# EAGLE design Sensorino (EAGLE 6.4)
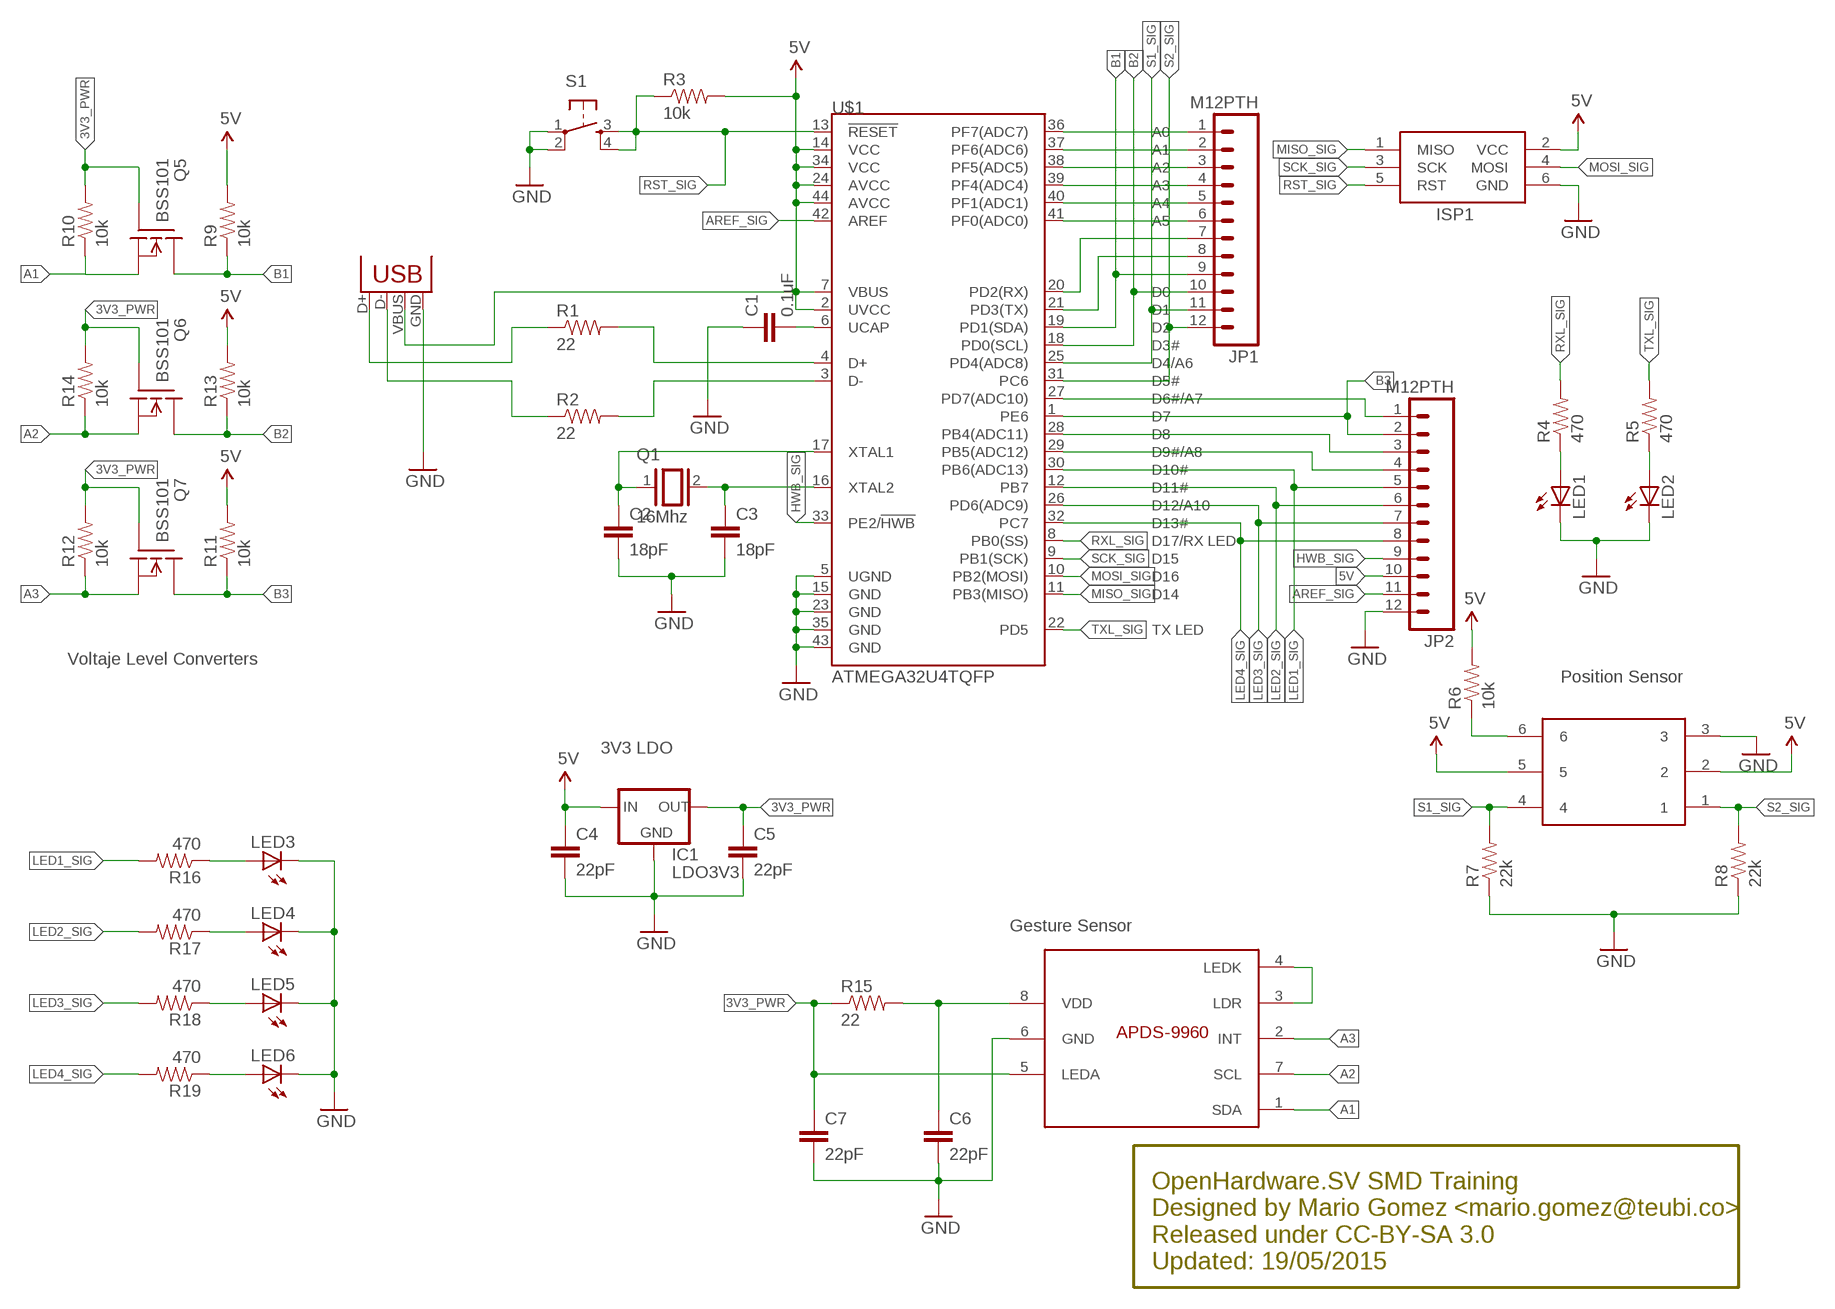
[diagram p0: schematic, sheet 1]

## Parts
C1  0.1uF  0.1UF-50V-20%(PTH)KIT-EZ  [CAP-PTH-SMALL-KIT]
C2  18pF  0.1UF-50V-20%(PTH)KIT-EZ  [CAP-PTH-SMALL-KIT]
C3  18pF  0.1UF-50V-20%(PTH)KIT-EZ  [CAP-PTH-SMALL-KIT]
C4  22pF  0.1UF-50V-20%(PTH)KIT-EZ  [CAP-PTH-SMALL-KIT]
C5  22pF  0.1UF-50V-20%(PTH)KIT-EZ  [CAP-PTH-SMALL-KIT]
C6  22pF  0.1UF-50V-20%(PTH)KIT-EZ  [CAP-PTH-SMALL-KIT]
C7  22pF  0.1UF-50V-20%(PTH)KIT-EZ  [CAP-PTH-SMALL-KIT]
IC1  LDO3V3  78XXL  [78XXL]
ISP1  AVRISP-6  [AVRISP]
JP1  M12PTH  [1X12]
JP2  M12PTH  [1X12]
LED1  LED5MM  [LED5MM]
LED2  LED5MM  [LED5MM]
LED3  LED5MM  [LED5MM]
LED4  LED5MM  [LED5MM]
LED5  LED5MM  [LED5MM]
LED6  LED5MM  [LED5MM]
Q1  16Mhz  XTAL/S  [QS]
Q5  BSS101  [TO92]
Q6  BSS101  [TO92]
Q7  BSS101  [TO92]
R1  22  RESISTORAXIAL-0.3  [AXIAL-0.3]
R2  22  RESISTORAXIAL-0.3  [AXIAL-0.3]
R3  10k  RESISTORAXIAL-0.3  [AXIAL-0.3]
R4  470  RESISTORAXIAL-0.3  [AXIAL-0.3]
R5  470  RESISTORAXIAL-0.3  [AXIAL-0.3]
R6  10k  RESISTORAXIAL-0.3  [AXIAL-0.3]
R7  22k  RESISTORAXIAL-0.3  [AXIAL-0.3]
R8  22k  RESISTORAXIAL-0.3  [AXIAL-0.3]
R9  10k  RESISTORAXIAL-0.3  [AXIAL-0.3]
R10  10k  RESISTORAXIAL-0.3  [AXIAL-0.3]
R11  10k  RESISTORAXIAL-0.3  [AXIAL-0.3]
R12  10k  RESISTORAXIAL-0.3  [AXIAL-0.3]
R13  10k  RESISTORAXIAL-0.3  [AXIAL-0.3]
R14  10k  RESISTORAXIAL-0.3  [AXIAL-0.3]
R15  22  RESISTORAXIAL-0.3  [AXIAL-0.3]
R16  470  RESISTORAXIAL-0.3  [AXIAL-0.3]
R17  470  RESISTORAXIAL-0.3  [AXIAL-0.3]
R18  470  RESISTORAXIAL-0.3  [AXIAL-0.3]
R19  470  RESISTORAXIAL-0.3  [AXIAL-0.3]
S1  TAC_SWITCHPTH  [TACTILE-PTH]
U$1  ATMEGA32U4TQFP  [SPARKFUN-DIGITALIC_TQFP44]
U$2  USBPTH  [USB-B-PTH]
U$3  RPI-1031  [RPI-1031]
U$4  APDS-9960  [APDS-9960]

## Nets
3V3_PWR: C5.1 C7.1 IC1.OUT Q5.2(G) Q6.2(G) Q7.2(G) R10.P$2 R12.P$2 R14.P$2 R15.P$1 U$4.5(LEDA)
5V: C4.1 IC1.IN ISP1.2(VCC) JP2.10 R3.P$2 R6.P$2 R9.P$2 R11.P$2 R13.P$2 U$1.2(UVCC) U$1.7(VBUS) U$1.14(VCC) U$1.24(AVCC) U$1.34(VCC) U$1.44(AVCC) U$2.VBUS U$3.2 U$3.5
A1: Q5.1(S) R10.P$1 U$4.1(SDA)
A2: Q6.1(S) R14.P$1 U$4.7(SCL)
A3: Q7.1(S) R12.P$1 U$4.2(INT)
AREF_SIG: JP2.11 U$1.42(AREF)
B1: JP1.9 Q5.3(D) R9.P$1 U$1.19(PD1(SDA))
B2: JP1.10 Q6.3(D) R13.P$1 U$1.18(PD0(SCL))
B3: JP2.2 Q7.3(D) R11.P$1 U$1.1(PE6)
GND: C1.1 C2.2 C3.2 C4.2 C5.2 C6.2 C7.2 IC1.GND ISP1.6(GND) JP2.12 LED1.K(C) LED2.K(C) LED3.K(C) LED4.K(C) LED5.K(C) LED6.K(C) R7.P$1 R8.P$1 S1.1 S1.2 U$1.5(UGND) U$1.15(GND) U$1.23(GND) U$1.35(GND) U$1.43(GND) U$2.GND U$3.3 U$4.6(GND)
HWB_SIG: JP2.9 U$1.33(PE2/!HWB)
LED1_SIG: JP2.5 R16.P$2 U$1.30(PB6(ADC13))
LED2_SIG: JP2.6 R17.P$2 U$1.12(PB7)
LED3_SIG: JP2.7 R18.P$2 U$1.26(PD6(ADC9))
LED4_SIG: JP2.8 R19.P$2 U$1.32(PC7)
MISO_SIG: ISP1.1(MISO) U$1.11(PB3(MISO))
MOSI_SIG: ISP1.4(MOSI) U$1.10(PB2(MOSI))
N$1: R2.P$2 U$1.3(D-)
N$2: R1.P$2 U$1.4(D+)
N$3: R1.P$1 U$2.D+
N$4: R2.P$1 U$2.D-
N$5: JP2.1 U$1.27(PD7(ADC10))
N$6: C1.2 U$1.6(UCAP)
N$7: C3.1 Q1.2 U$1.16(XTAL2)
N$8: C2.1 Q1.1 U$1.17(XTAL1)
N$9: LED3.A R16.P$1
N$10: JP2.3 U$1.28(PB4(ADC11))
N$11: LED1.A R4.P$1
N$12: LED2.A R5.P$1
N$13: JP1.1 U$1.36(PF7(ADC7))
N$14: JP1.2 U$1.37(PF6(ADC6))
N$15: JP1.3 U$1.38(PF5(ADC5))
N$16: JP1.4 U$1.39(PF4(ADC4))
N$17: JP1.5 U$1.40(PF1(ADC1))
N$18: JP1.6 U$1.41(PF0(ADC0))
N$19: JP1.7 U$1.20(PD2(RX))
N$20: JP1.8 U$1.21(PD3(TX))
N$21: LED4.A R17.P$1
N$22: LED5.A R18.P$1
N$23: LED6.A R19.P$1
N$25: JP2.4 U$1.29(PB5(ADC12))
N$30: R6.P$1 U$3.6
N$31: U$4.3(LDR) U$4.4(LEDK)
N$32: C6.1 R15.P$2 U$4.8(VDD)
RST_SIG: ISP1.5(RST) R3.P$1 S1.3 S1.4 U$1.13(!RESET)
RXL_SIG: R4.P$2 U$1.8(PB0(SS))
S1_SIG: JP1.11 R7.P$2 U$1.25(PD4(ADC8)) U$3.4
S2_SIG: JP1.12 R8.P$2 U$1.31(PC6) U$3.1
SCK_SIG: ISP1.3(SCK) U$1.9(PB1(SCK))
TXL_SIG: R5.P$2 U$1.22(PD5)

## Notes on the sheet
- Voltaje Level Converters
- Position Sensor
- 3V3 LDO
- Gesture Sensor
- OpenHardware.SV SMD Training
  Designed by Mario Gomez <mario.gomez@teubi.co>
  Released under CC-BY-SA 3.0
  Updated: 19/05/2015

## Library data of the parts
C1-C7 = SparkFun-Capacitors:0.1UF-50V-20%(PTH): CAP-08370; PROD_ID: CAP-08370
IC1 = v-reg:78XXL: VOLTAGE REGULATOR
ISP1 = adafruit:AVRISP: AVR ISP HEADER Standard 6 pin header for AVR programming
JP1 JP2 = SparkFun-Connectors:M12: Header 12 Standard 12-pin 0.1" header. Use with straight break away headers (SKU : PRT-00116), right angle break away headers (PRT-00553), swiss pins (PRT-00743), machine pins (PRT-00117), and female headers (PRT-00115).
LED1-LED6 = SparkFun-LED:LED: LEDs Standard schematic elements and footprints for 5mm, 3mm, 1206, and 0603 sized LEDs. 5mm - Spark Fun Electronics SKU : COM-00529 (and others)
Q1 = special:XTAL/S: CRYSTAL
Q5-Q7 = transistor-fet:BSS101: N-Channel Enhancement MOSFET 200V; 0,16A; 11Ohm
R1-R19 = SparkFun-Resistors:RESISTOR: Resistor Basic schematic elements and footprints for 0603, 1206, and PTH resistors.
S1 = SparkFun-Electromechanical:TAC_SWITCH: Momentary Switch Button commonly used for reset or general input. Spark Fun Electronics SKU : COM-00097 SMT- SWCH-08247
U$1 = SparkFun-DigitalIC:ATMEGA32U4: Atmel 44-pin 8-bit Microcontroller with 32KBytes of ISP Flash and USB Controller ----- Please use the QFN-44-NOPAD_1:1 package for the footprint of all boards using a 32U4. Route traces directly away from the pads as much as possible.
U$2 = SparkFun-Connectors:USB: USB Connectors USB-B-PTH is fully proven SKU : PRT-00139/CONN-08278 USB-miniB is fully proven SKU : PRT-00587 USB-A-PCB is untested. USB-A-H is throughly reviewed, but untested. Spark Fun Electronics SKU : PRT-00437 USB-B-SMT is throughly reviewed, but untested. Needs silkscreen touching up. USB-A-S has not been used/tested USB-MB-H has not been used/tested USB-MICROB has been used. CONN-09505; PROD_ID: CONN-08278; VALUE: USB-B
U$3 = custom_components:RPI-1031
U$4 = custom_components:APDS-9960

## Board
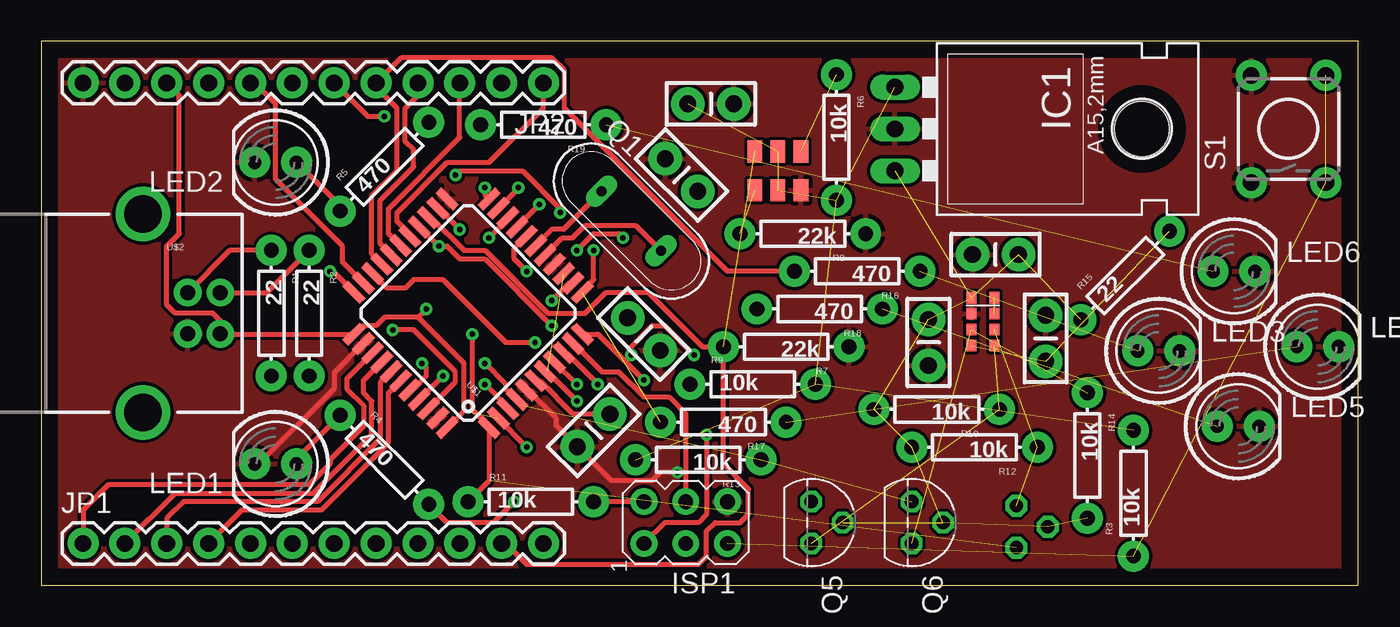
[diagram p1: board, top side]
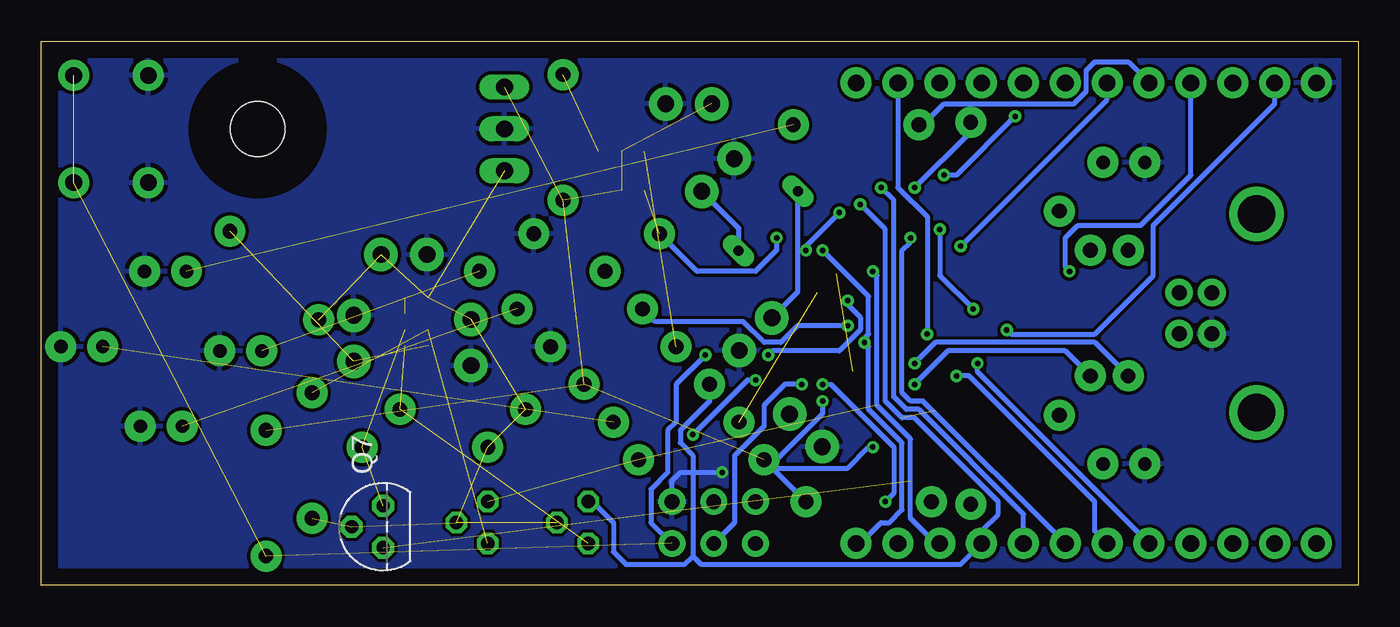
[diagram p2: board, bottom side, seen from below]

Size 79.93 x 33.01 mm. Coordinates in mm from the lower left corner, seen from the top.
Outline: 0,0 79.93,0 79.93,33.01 0,33.01 0,0
Copper layers (1*16): Top 0.035mm / dielectric 1.5mm / Bottom 0.035mm
Design rules "default": minimum track width 10mil, minimum drill 24mil, track to track 8mil, track to pad 8mil, pad to pad 8mil, via to via 8mil, smd to smd 8mil, copper to edge 40mil, drill to drill 8mil, minimum pad ring 10mil, minimum via ring 8mil, stop-mask expansion 4mil, vias tented up to drill 0mil, thermal gap 10mil

### Footprints (pad centres in the part's own frame; a part is rotated, then mirrored left to right if it is on the bottom)
CAP-PTH-SMALL-KIT = drill 1.016 pad 2.032: 1 -1.397,0; 2 1.397,0
78XXL = drill 1.016 long: GND 0,-3.81; IN -2.54,-3.81; OUT 2.54,-3.81 | hole 3.302: 0,11.176
AVRISP = drill 0.9 pad 1.626: 1 -1.27,2.54; 2 1.27,2.54; 3 -1.27,0; 4 1.27,0; 5 -1.27,-2.54; 6 1.27,-2.54
1X12 = drill 1.016 pad 1.88: 1 0,0; 2 2.54,0; 3 5.08,0; 4 7.62,0; 5 10.16,0; 6 12.7,0; 7 15.24,0; 8 17.78,0; 9 20.32,0; 10 22.86,0; 11 25.4,0; 12 27.94,0
LED5MM = drill 0.813 pad 1.88: A -1.27,0; K 1.27,0
QS = drill 0.61 long: 1 -2.54,0; 2 2.54,0
TO92 = drill 0.813 octagon: 1 1.27,0; 2 0,1.905; 3 -1.27,0
AXIAL-0.3 = drill 0.9 pad 1.88: P$1 -3.81,0; P$2 3.81,0
TACTILE-PTH = drill 1.016 pad 1.88: 1 -3.251,2.261; 2 3.251,2.261; 3 -3.251,-2.261; 4 3.251,-2.261
SPARKFUN-DIGITALIC_TQFP44 = smd 1.5 x 0.5: 1 -5.8,4; 2 -5.8,3.2; 3 -5.8,2.4; 4 -5.8,1.6; 5 -5.8,0.8; 6 -5.8,0; 7 -5.8,-0.8; 8 -5.8,-1.6; 9 -5.8,-2.4; 10 -5.8,-3.2; 11 -5.8,-4; 23 5.8,-4; 24 5.8,-3.2; 25 5.8,-2.4; 26 5.8,-1.6; 27 5.8,-0.8; 28 5.8,0; 29 5.8,0.8; 30 5.8,1.6; 31 5.8,2.4; 32 5.8,3.2; 33 5.8,4 | smd 0.5 x 1.5: 12 -4,-5.8; 13 -3.2,-5.8; 14 -2.4,-5.8; 15 -1.6,-5.8; 16 -0.8,-5.8; 17 0,-5.8; 18 0.8,-5.8; 19 1.6,-5.8; 20 2.4,-5.8; 21 3.2,-5.8; 22 4,-5.8; 34 4,5.8; 35 3.2,5.8; 36 2.4,5.8; 37 1.6,5.8; 38 0.8,5.8; 39 0,5.8; 40 -0.8,5.8; 41 -1.6,5.8; 42 -2.4,5.8; 43 -3.2,5.8; 44 -4,5.8
USB-B-PTH = drill 0.914 pad 1.676: D+ 0,1.25; D- 1.981,1.25; GND 0,-1.25; VBUS 1.981,-1.25 | drill 2.286: S1 -2.718,-6.02; S2 -2.718,6.02
RPI-1031 = smd 1.35 x 0.9: 1 1.175,-1.4; 2 1.175,0; 3 1.175,1.4; 4 -1.175,-1.4; 5 -1.175,0; 6 -1.175,1.4
APDS-9960 = smd 0.6 x 0.72: 1 -0.7,1.455; 2 -0.7,0.485; 3 -0.7,-0.485; 4 -0.7,-1.455; 5 0.7,-1.455; 6 0.7,-0.485; 7 0.7,0.485; 8 0.7,1.455

### Placement (x,y rotation side)
C1  33.53,9.4 45 top
C2  36.58,15.24 315 top
C3  38.86,24.89 135 top
C4  40.64,29.21 0 top
C5  57.91,20.07 180 top
C6  60.96,14.99 90 top
C7  53.85,14.73 270 top
IC1  55.63,27.69 270 top
ISP1  39.12,3.81 90 top
JP1  2.54,2.54 0 top
JP2  30.48,30.48 180 top
LED1  14.22,7.37 180 top
LED2  14.22,25.65 180 top
LED3  67.82,14.22 0 top
LED4  77.47,14.48 0 top
LED5  72.64,9.65 0 top
LED6  72.39,19.05 0 top
Q1  35.81,22.1 315 top
Q5  46.74,3.81 270 top
Q6  52.83,3.81 270 top
Q7  59.18,3.56 90 bottom
R1  13.97,16.51 270 top
R2  16.26,16.51 270 top
R3  66.29,5.59 90 top
R4  20.83,7.62 315 top
R5  20.83,25.4 45 top
R6  48.26,27.18 270 top
R7  45.21,14.48 180 top
R8  46.23,21.34 180 top
R9  43.18,12.19 0 top
R10  54.36,10.67 180 top
R11  29.72,5.08 0 top
R12  56.64,8.38 180 top
R13  39.88,7.62 180 top
R14  63.5,7.87 270 top
R15  65.79,18.8 45 top
R16  49.53,19.05 180 top
R17  41.4,9.91 180 top
R18  47.24,16.76 180 top
R19  30.48,27.94 180 top
S1  75.69,27.69 90 top
U$1  25.91,16.51 135 top
U$2  8.89,16.51 0 top
U$3  44.7,25.15 270 top
U$4  57.15,16 180 top

### Tracks (layer width: path | path; a pad name or v marks a point on that pad's centre or on a via)
3V3_PWR  (10 unrouted)
5V  (via drill 0.33 pad 0.18)  (9 unrouted)
  Top 0.305: U$1.7 30.71,12.97 v32.51,11.18 | v29.46,8.38 27.75,10.1 U$1.2 | U$1.44 25.65,10.6 25.65,13.46 22.86,16.26 | 22.86,16.26 20.83,16.26 20.32,15.75 19.56,15.75 19.05,15.24 U$1.34 10.89,15.24 U$2.VBUS 10.87,16.05 10.41,16.51 8.13,16.51 7.62,17.02 7.62,20.57 8.38,21.34 8.38,29.72 JP2.10 | U$1.24 24.12,22.87 v25.4,21.59 | v23.37,16.76 22.86,16.26 | ISP1.2 R11.P$2
  Bottom 0.305: v32.51,11.18 32.51,10.41 35.31,7.62 R13.P$2 | R13.P$2 35.56,7.11 30.99,7.11 29.72,8.38 v29.46,8.38 | v25.4,21.59 25.4,18.8 v23.37,16.76 | R13.P$2 R11.P$2
A1  (2 unrouted)
A2  (2 unrouted)
A3  (2 unrouted)
AREF_SIG  (via drill 0.33 pad 0.18)
  Top 0.305: U$1.42 25.15,12.35 25.15,12.95 22.61,15.49 v21.34,15.49
  Bottom 0.305: v21.34,15.49 21.08,15.24 16,15.24 12.45,18.8 12.45,21.84 5.08,29.21 JP2.11
B1  (via drill 0.33 pad 0.18)
  Top 0.305: v30.23,23.11 30.23,23.09 U$1.19
  Bottom 0.305: v30.23,23.11 28.7,21.59 28.7,11.18 27.69,10.16 26.92,10.16 21.84,5.08 21.84,4.32 22.86,3.3 JP1.9 24.13,1.27 39.88,1.27 40.39,1.78 | R9.P$1 39.37,11.18 41.15,9.4 41.15,8.64 40.39,7.87 40.39,1.78 | Q5.3 46.48,5.08 45.21,3.81 45.21,2.03 44.45,1.27 40.89,1.27 40.39,1.78
B2  (via drill 0.33 pad 0.18)  (2 unrouted)
  Top 0.305: v29.46,19.05 28.7,19.81 28.7,20.43 U$1.18
  Bottom 0.305: JP1.10 25.65,2.54 27.18,4.06 27.18,8.89 29.21,10.92 29.21,18.8 v29.46,19.05
B3  (via drill 0.33 pad 0.18)  (1 unrouted)
  Top 0.305: R11.P$1 27.18,6.35 U$1.1 27.18,9.65 26.16,10.67 v26.16,15.24
  Bottom 0.305: JP2.2 27.94,24.13 26.16,22.35 v26.16,15.24
GND  (via drill 0.33 pad 0.18)
  Top 0.305: U$1.35 17.78,12.91 17.78,11.94 13.21,7.37 LED1.K | U$1.5 29.56,11.84 31.24,10.16 31.24,9.71 C1.1 34.6,6.35 37.08,6.35 37.59,6.86 v38.61,6.86
  Bottom 0.305: ISP1.6 41.66,6.35 41.15,6.86 v38.61,6.86
  pour Top: 0,0 79.76,0 79.76,33.02 0,33.02
  pour Bottom: 0,0 79.76,0 79.76,33.02 0,33.02
HWB_SIG  (via drill 0.33 pad 0.18)
  Top 0.305: U$1.33 17.71,19.05 v17.53,19.05
  Bottom 0.305: v17.53,19.05 17.78,19.3 17.78,21.08 17.02,21.84 13.21,21.84 10.16,24.89 JP2.9
LED1_SIG
  Top 0.305: U$1.30 20.07,20.09 20.07,23.62 21.59,25.15 21.59,28.96 20.32,30.23 JP2.5 21.84,32 30.99,32 31.75,31.24 31.75,28.96 41.66,19.05 R16.P$2
LED2_SIG  (via drill 0.33 pad 0.18)  (1 unrouted)
  Top 0.305: JP2.6 19.81,28.45 v20.83,28.45 | v25.15,24.89 25.4,25.15 29.21,25.15 31.5,22.86 v31.5,22.61 | U$1.12 32.84,17.85 33.53,18.54 v33.53,20.32
  Bottom 0.305: v20.83,28.45 24.38,24.89 v25.15,24.89 | v31.5,22.61 33.53,20.57 v33.53,20.32
LED3_SIG  (via drill 0.33 pad 0.18)
  Top 0.305: U$1.26 24.11,20.57 v24.13,20.57 24.64,20.57 25.4,19.81 26.92,19.81 v30.99,15.75
  Bottom 0.305: v24.13,20.57 15.24,29.46 JP2.7 | v30.99,15.75 34.04,15.75 35.05,14.73 36.07,14.73 37.34,16 42.67,16 R18.P$2
LED4_SIG
  Top 0.305: U$1.32 18.29,19.61 18.29,20.57 14.22,24.64 14.22,29.21 12.95,30.48 JP2.8
  Bottom 0.305: R19.P$2 26.42,27.94 25.15,29.21 17.27,29.21 16.51,29.97 16.51,31.24 16,31.75 13.97,31.75 JP2.8
MISO_SIG  (via drill 0.33 pad 0.18)
  Top 0.305: U$1.11 33.78,15.24 v36.58,12.45 | v40.39,9.14 40.39,4.32 39.88,3.81 37.85,3.81 ISP1.1
  Bottom 0.305: v36.58,12.45 37.08,12.45 v40.39,9.14
MOSI_SIG
  Top 0.305: U$1.10 32.32,14.67 34.04,12.95 35.05,12.95 36.58,11.43 38.1,11.43 39.12,10.41 ISP1.4
N$1  (via drill 0.33 pad 0.18)
  Top 0.305: v26.92,12.19 28.31,10.8 U$1.3
  Bottom 0.305: R2.P$2 17.78,14.22 24.89,14.22 v26.92,12.19
N$2  (via drill 0.33 pad 0.18)
  Top 0.305: v26.92,13.46 28.19,12.19 28.19,11.94 28.86,11.28 U$1.4
  Bottom 0.305: R1.P$2 16,14.73 25.65,14.73 v26.92,13.46
N$3
  Top 0.305: R1.P$1 11.45,20.32 U$2.D+
N$4
  Top 0.305: U$2.D- 13.7,17.76 R2.P$1
N$5
  Top 0.305: U$1.27 22.37,21.32 21.59,22.1 21.59,22.61 24.64,25.65 27.18,25.65 30.48,28.96 JP2.1
N$6
  Top 0.305: U$1.6 30.26,12.41 32.26,10.41 34.49,10.41 C1.2
N$7
  Top 0.305: U$1.16 31.61,21.08 32.26,21.08 33.02,21.84 36.07,21.84 Q1.2 | Q1.2
  Bottom 0.305: C3.1 37.61,21.66 Q1.2
N$8
  Top 0.305: Q1.1 31.71,21.59 30.99,21.59 U$1.17
  Bottom 0.305: C2.1 34.02,17.8 Q1.1
N$9  (1 unrouted)
N$10
  Top 0.305: U$1.28 21.08,21.34 21.08,22.86 25.4,27.18 JP2.3
N$11
  Top 0.305: LED1.A 15.49,7.67 R4.P$1
N$12
  Top 0.305: R5.P$1 18.13,23.01 LED2.A
N$13
  Top 0.305: U$1.36 18.54,12.54 18.54,11.94 19.56,10.92 19.56,9.65 17.53,7.62 17.53,7.37 16.26,6.1 4.06,6.1 2.54,4.57 JP1.1
N$14
  Top 0.305: JP1.2 8.13,5.59 16.51,5.59 20.07,9.14 20.07,11.18 19.56,11.68 19.56,12.45 20.65,13.54 U$1.37
N$15
  Top 0.305: U$1.38 20.57,12.31 20.57,8.89 16.76,5.08 8.64,5.08 7.62,4.06 JP1.3
N$16
  Top 0.305: JP1.4 12.19,4.57 17.02,4.57 21.08,8.64 21.08,11.68 U$1.39
N$17  (via drill 0.33 pad 0.18)
  Top 0.305: v23.11,13.46 23.37,13.21 23.37,12.7 22.51,11.84 U$1.40
  Bottom 0.305: JP1.5 23.11,12.95 v23.11,13.46
N$18  (via drill 0.33 pad 0.18)
  Top 0.305: v24.38,12.7 22.96,11.28 U$1.41
  Bottom 0.305: JP1.6 16,3.3 16,5.08 23.62,12.7 v24.38,12.7
N$19  (via drill 0.33 pad 0.18)
  Top 0.305: v27.18,21.08 28.31,22.22 U$1.20
  Bottom 0.305: JP1.7 26.42,11.18 27.18,11.18 27.69,11.68 27.69,20.32 27.18,20.83 v27.18,21.08
N$20  (via drill 0.33 pad 0.18)
  Top 0.305: v28.96,24.13 28.96,24.08 U$1.21
  Bottom 0.305: JP1.8 20.32,4.32 26.67,10.67 27.43,10.67 28.19,11.43 28.19,23.37 v28.96,24.13
N$21  (1 unrouted)
N$22  (1 unrouted)
N$23  (1 unrouted)
N$25
  Top 0.305: U$1.29 20.57,20.71 20.57,23.37 22.61,25.4 22.61,26.42 22.1,26.92 22.1,28.96 22.86,29.72 JP2.4
N$30  (1 unrouted)
N$31  (1 unrouted)
N$32  (2 unrouted)
RST_SIG  (via drill 0.33 pad 0.18)  (3 unrouted)
  Top 0.305: U$1.13 32.06,18.35 v30.99,17.27 | v35.81,13.97 35.81,14.48 37.08,15.75 37.85,15.75 v39.62,13.97
  Bottom 0.305: v30.99,17.27 30.99,17.02 30.23,16.26 30.23,15.49 31.5,14.22 35.56,14.22 v35.81,13.97 | v39.62,13.97 41.4,12.19 41.4,9.91 41.91,9.4 41.91,6.86 42.93,5.84 42.93,3.81 ISP1.5
RXL_SIG  (via drill 0.33 pad 0.18)
  Top 0.305: U$1.8 31.16,13.54 v32.51,12.19 | v28.7,5.08 27.43,3.81 24.64,3.81 R4.P$2
  Bottom 0.305: v32.51,12.19 32,12.19 28.19,8.38 28.19,5.59 v28.7,5.08
S1_SIG  (1 unrouted)
  Top 0.305: U$1.25 23.67,22.31 25.65,20.32 26.92,20.32 30.73,16.51 33.02,16.51 34.29,17.78 36.83,17.78 40.13,14.48 R7.P$2 41.4,7.37 42.93,5.84 42.93,4.32 42.42,3.81 40.89,3.81 40.39,3.3 40.39,1.78 39.88,1.27 29.46,1.27 28.19,2.54 JP1.11
S2_SIG  (via drill 0.33 pad 0.18)  (1 unrouted)
  Top 0.305: U$1.31 20.99,18.03 22.1,18.03 22.61,18.54 24.38,18.54 28.19,14.73 v29.97,14.73 | v32.51,20.32 33.53,21.34 35.05,21.34 v35.31,21.08
  Bottom 0.305: JP1.12 30.23,2.54 28.96,3.81 28.45,3.81 27.69,4.57 27.69,8.64 29.72,10.67 29.72,14.48 v29.97,14.73 29.97,14.99 29.72,15.24 29.72,17.53 v32.51,20.32 | v35.31,21.08 35.31,20.32 36.58,19.05 40.13,19.05 R8.P$2
SCK_SIG  (via drill 0.33 pad 0.18)
  Top 0.305: U$1.9 31.87,14.11 v33.78,12.19
  Bottom 0.305: v33.78,12.19 34.8,12.19 36.07,10.92 36.07,9.65 37.85,7.87 37.85,3.81 ISP1.3
TXL_SIG  (via drill 0.33 pad 0.18)
  Top 0.305: U$1.22 26.92,23.7 v26.92,24.13
  Bottom 0.305: v26.92,24.13 23.52,27.53 R5.P$2